# EAGLE design Sensor-BMP280 (EAGLE 7.7.0)
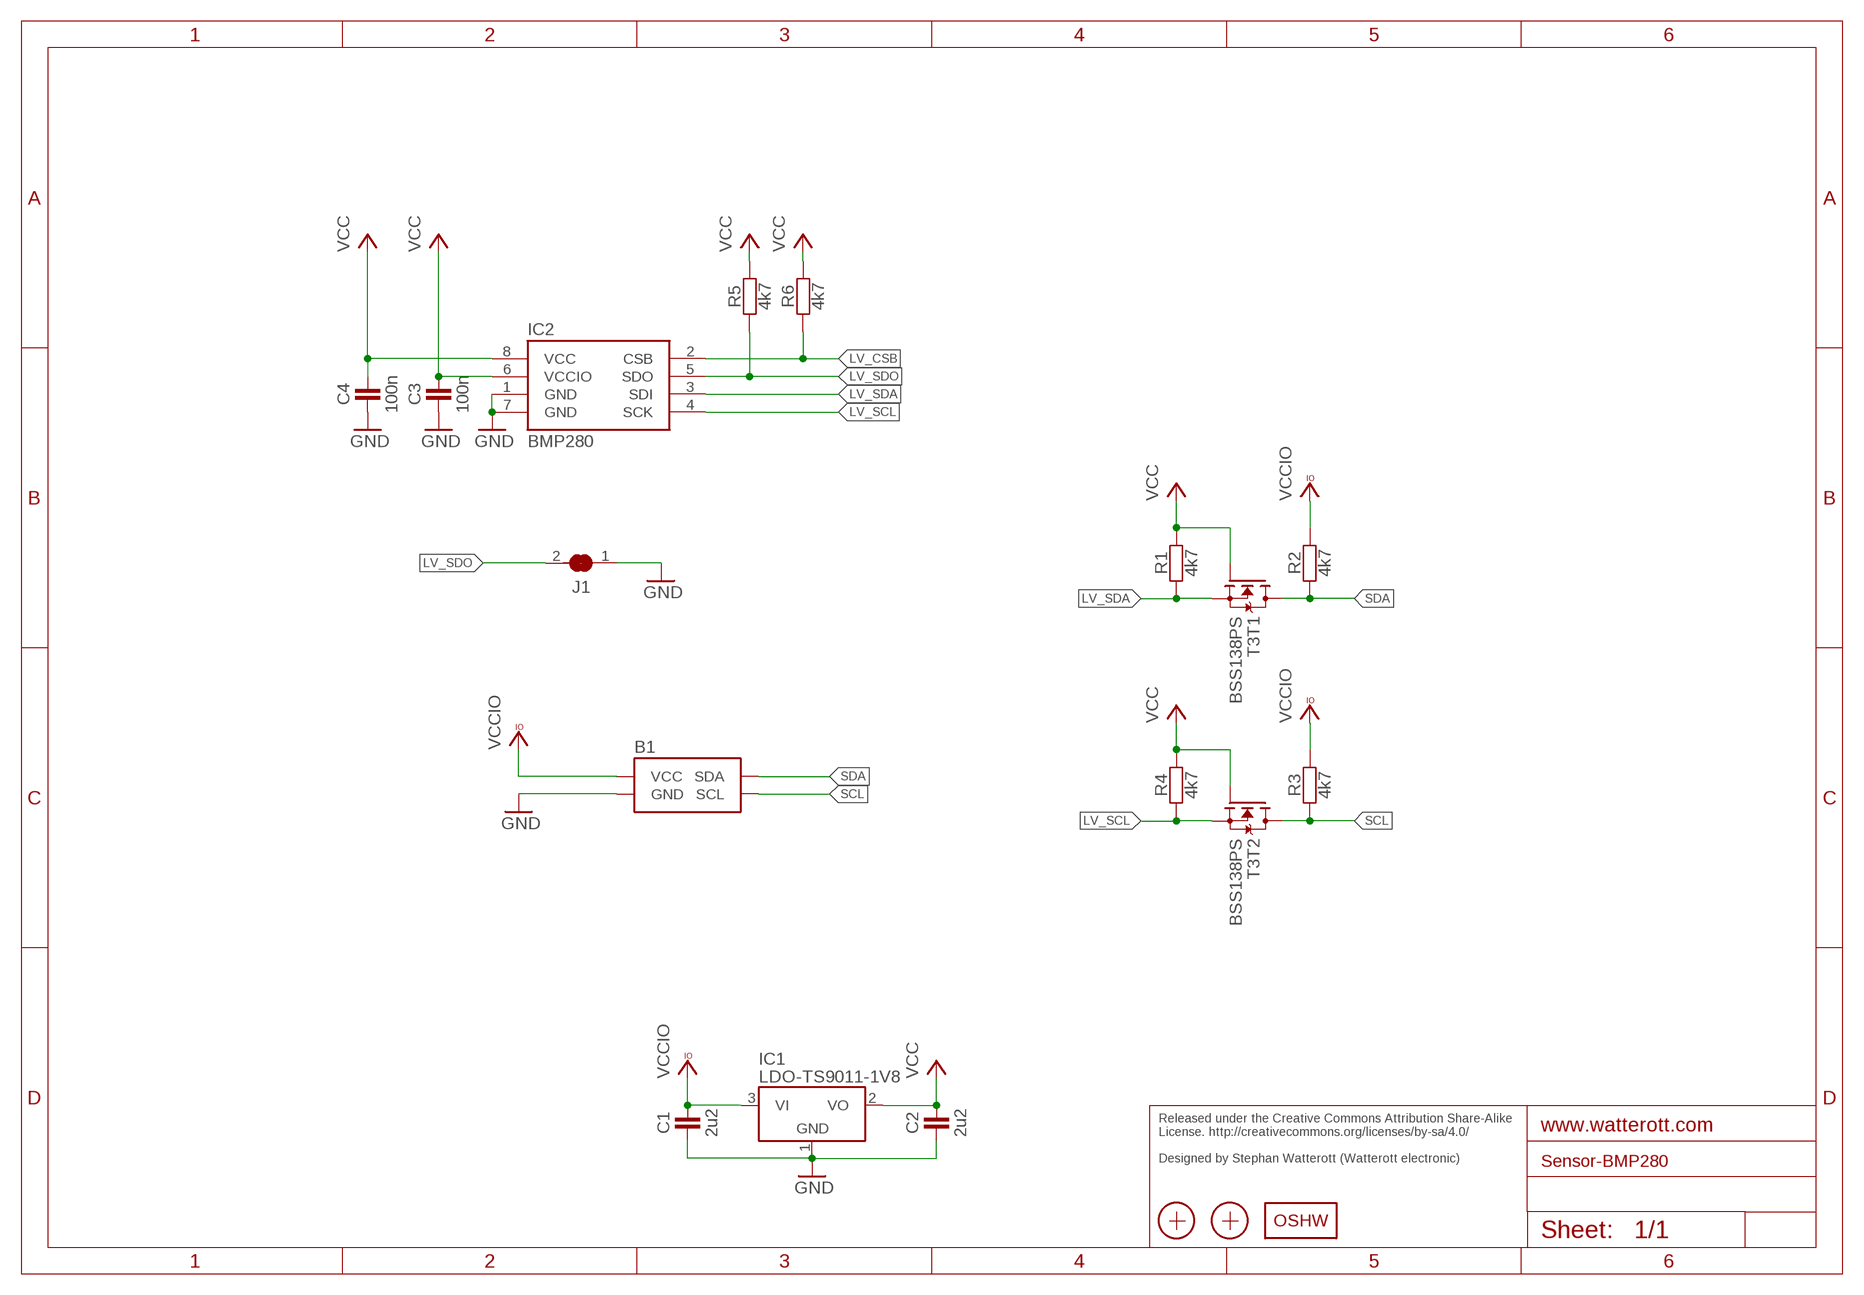
[diagram p0: schematic, sheet 1]

## Parts
B1  SENSEBOX_I2C  [SENSEBOX_I2C]
C1  2u2  CAPACITOR-0402  [C0402]
C2  2u2  CAPACITOR-0402  [C0402]
C3  100n  CAPACITOR-0402  [C0402]
C4  100n  CAPACITOR-0402  [C0402]
IC1  LDO-TS9011-1V8  LDO-TS9011-3V3  [SOT23]
IC2  BMP280  [LGA8]
J1  JUMPER2-0402-NC  [JUMPER2-0402_NC]
LOGO2  OSHW_LOGOX0070  [OSHW_6X70]
R1  4k7  RESISTOR-0402  [C0402]
R2  4k7  RESISTOR-0402  [C0402]
R3  4k7  RESISTOR-0402  [C0402]
R4  4k7  RESISTOR-0402  [C0402]
R5  4k7  RESISTOR-0402  [C0402]
R6  4k7  RESISTOR-0402  [C0402]
T3  BSS138PS  [SOT363]
X1  PASSER-07  [PASSER_07MM]
X2  PASSER-07  [PASSER_07MM]

## Nets
GND: B1.GND C1.1 C2.1 C3.1 C4.1 IC1.1(GND) IC2.1(GND) IC2.7(GND) J1.1
LV_CSB: IC2.2(CSB) R6.1
LV_SCL: IC2.4(SCK) R4.1 T3.4(T2:S)
LV_SDA: IC2.3(SDI) R1.1 T3.1(T1:S)
LV_SDO: IC2.5(SDO) J1.2 R5.1
SCL: B1.SCL R3.1 T3.3(T2:D)
SDA: B1.SDA R2.1 T3.6(T1:D)
VCC: C2.2 C3.2 C4.2 IC1.2(VO) IC2.6(VCCIO) IC2.8(VCC) R1.2 R4.2 R5.2 R6.2 T3.2(T1:G) T3.5(T2:G)
VCCIO: B1.VCC C1.2 IC1.3(VI) R2.2 R3.2

## Notes on the sheet
- Released under the Creative Commons Attribution Share-Alike 
  License. http://creativecommons.org/licenses/by-sa/4.0/
  
  Designed by Stephan Watterott (Watterott electronic)

## Library data of the parts
B1 = we-board:SENSEBOX_I2C: SenseBox Sensors/Breakouts
C1-C4 = we-rcl:CAPACITOR: Capacitors ...2.2uF @ 6.3V -> 0402 ...4.7uF @ 6.3V -> 0603 ...10uF @ 16V -> 0805 ...22uF @ 25V -> 1206
IC1 = we-power:LDO: LDOs TS1117 800mA, Vin max 12V TS9011 250mA, Vin max 12V - compatible AP2210 300mA, Vin max 15V TS5204 150mA, Vin max 16V
IC2 = we-sensor:BMP280: Bosch BMP280 Pressure Sensor
J1 = we-rcl:JUMPER2: 2 Pin Jumpers
LOGO2 = we-symbol:OSHW_LOGO: Open-Source-Hardware Logo
R1-R6 = we-rcl:RESISTOR: Resistors all kinds in 0402 and 0603
T3 = we-transistor:BSS138PS: Dual N-Channel MOSFET BSS138 (Vgs>=+/-20V, Vds>=40V, Id>=0.2A + Rds<=3Ohm @ Vgs=4.5V)
X1 X2 = we-symbol:PASSER: Fiducial Markers

## Board
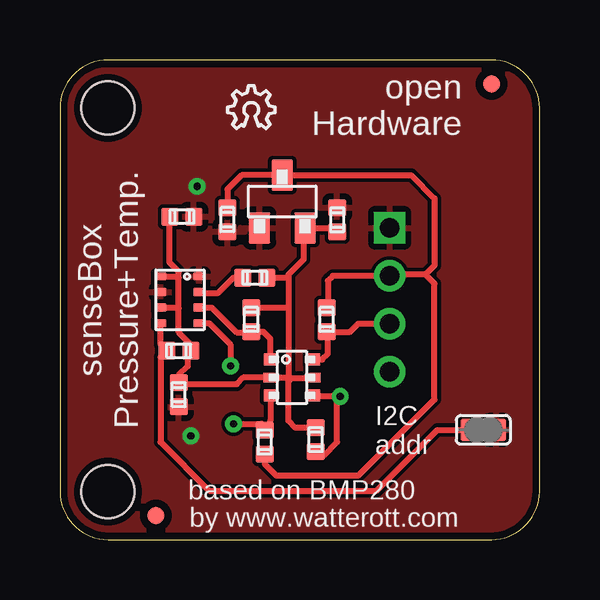
[diagram p1: board, top side]
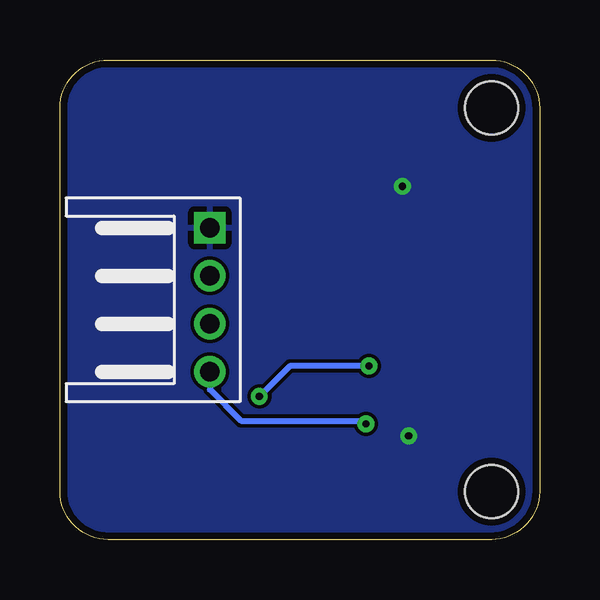
[diagram p2: board, bottom side, seen from below]

Size 20 x 20 mm. Coordinates in mm from the lower left corner, seen from the top.
Copper layers (1*16): Top 0.035mm / dielectric 1.5mm / Bottom 0.035mm
Design rules "we-dru-2-layer *": minimum track width 0.15mm, minimum drill 0.3mm, track to track 0.15mm, track to pad 0.15mm, pad to pad 0.15mm, via to via 0.15mm, smd to smd 0.1mm, copper to edge 0.3mm, drill to drill 0.2mm, minimum pad ring 0.18mm, minimum via ring 0.2mm, stop-mask expansion 0.1mm, vias tented up to drill 0.5mm, thermal gap 0.25mm

### Footprints (pad centres in the part's own frame; a part is rotated, then mirrored left to right if it is on the bottom)
SENSEBOX_I2C = drill 0.8 pad 1.3 square: GND 13.75,13 | drill 0.8 pad 1.3: SCL 13.75,7; SDA 13.75,9; VCC 13.75,11 | hole 2.2: 2,18; 2,2
C0402 = smd 0.75 x 0.7: 1 0,0.5; 2 0,-0.5
SOT23 = smd 1.3 x 0.9: 1 -1.1,0.95; 2 -1.1,-0.95; 3 1.1,0
LGA8 = smd 0.5 x 0.35: 1 0.8,0.975; 2 0.8,0.325; 3 0.8,-0.325; 4 0.8,-0.975; 5 -0.8,-0.975; 6 -0.8,-0.325; 7 -0.8,0.325; 8 -0.8,0.975
JUMPER2-0402_NC = smd 0.9 x 0.8: 1 0,0.55; 2 0,-0.55
SOT363 = smd 0.6 x 0.5: 1 -0.9,0.75; 3 -0.9,-0.75; 4 0.9,-0.75; 6 0.9,0.75 | smd 0.6 x 0.4: 2 -0.9,0; 5 0.9,0
PASSER_07MM = smd 0.7 x 0.7: X 0,0

### Placement (x,y rotation side)
B1  0,0 0 top
C1  6.99,13.34 180 top
C2  11.56,13.34 0 top
C3  5.08,13.46 270 top
C4  4.95,6.03 180 top
IC1  9.27,14.1 90 top
IC2  5,10 0 top
J1  17.65,4.57 270 top
LOGO2  6.99,17.14 0 top
R1  7.98,9.17 180 top
R2  11.13,9.17 180 top
R3  8.53,4.06 0 top
R4  10.67,4.17 180 top
R5  4.95,7.87 90 top
R6  8.13,10.92 90 top
T3  9.68,6.76 0 top
X1  18,19 0 top
X2  4,1 0 top

### Tracks (layer width: path | path; a pad name or v marks a point on that pad's centre or on a via)
GND  (via drill 0.3)
  other vias: 5.46,4.32 5.71,14.73
  pour Top: 0,20 20,20 20,0 0,0
  pour Bottom: 0,20 20,20 20,0 0,0
LV_CSB
  Top 0.254: IC2.2 5.84,10.29 6.6,10.29 7.24,10.92 R6.1
LV_SCL  (via drill 0.3)
  Top 0.254: IC2.4 6.21,9.03 7.11,8.13 v7.11,7.24 | T3.4 10.62,5.97 v11.68,5.97 11.56,5.84 11.56,4.06 11.01,3.52 R4.1
  Bottom 0.254: v7.11,7.24 10.41,7.24 v11.68,5.97
LV_SDA
  Top 0.254: T3.1 8.76,7.52 8.76,8.38 8.48,8.67 R1.1 7.94,8.64 7.37,8.64 6.33,9.68 IC2.3
LV_SDO
  Top 0.254: IC2.5 4.2,8.13 R5.1 4.19,7.61 4.19,4.06 6.22,2.03 13.21,2.03 15.75,4.57 J1.2
SCL  (via drill 0.3)
  Top 0.254: T3.3 8.78,4.96 R3.1 8.42,4.83 v7.24,4.83
  Bottom 0.254: B1.SCL 13.75,6.26 12.45,4.95 7.37,4.95 v7.24,4.83
SDA
  Top 0.254: B1.SDA 12.43,9 12.06,8.64 11.16,8.64 R2.1 11.18,8.62 11.18,7.75 10.94,7.51 T3.6
VCC
  Top 0.254: 4.95,9.65 4.95,8.64 5.45,8.14 R5.2 5.33,7.75 5.33,7.24 4.95,6.86 C4.2 5.01,6.48 7.37,6.48 7.64,6.76 T3.2 8.8,6.73 9.53,6.73 | 4.95,9.65 4.95,10.92 | 4.95,10.92 4.95,11.18 4.57,11.56 C3.2 | IC2.8 4.9,10.97 4.95,10.92 | IC2.6 4.93,9.68 4.95,9.65 | R1.2 9.51,9.67 9.53,9.65 | 9.53,9.65 9.53,6.73 | 9.53,6.73 9.65,6.73 | 9.65,6.73 10.55,6.73 T3.5 | R4.2 9.81,4.67 9.53,4.95 9.53,6.6 9.65,6.73 | C2.2 11.39,13 IC1.2 10.16,12.94 10.16,11.68 9.53,11.05 9.53,10.92 | 9.53,10.92 9.53,9.65 | R6.2 9.53,10.92
VCCIO
  Top 0.254: C1.2 6.99,14.61 7.58,15.2 IC1.3 14.65,15.2 15.62,14.22 15.62,11.43 15.24,11.05 | 15.24,11.05 13.8,11.05 B1.VCC 11.38,11 11.18,10.79 11.18,9.87 R2.2 | R3.2 8.53,3.15 9.02,2.67 12.45,2.67 15.62,5.84 15.62,10.67 15.24,11.05

### Text on the board
tPlace: open / Hardware | senseBox / Pressure+Temp. | I2C / addr | based on BMP280 | by www.watterott.com